# EAGLE schematic STM32 control board (EAGLE 9.6.1)

## Sheet 1 of 2
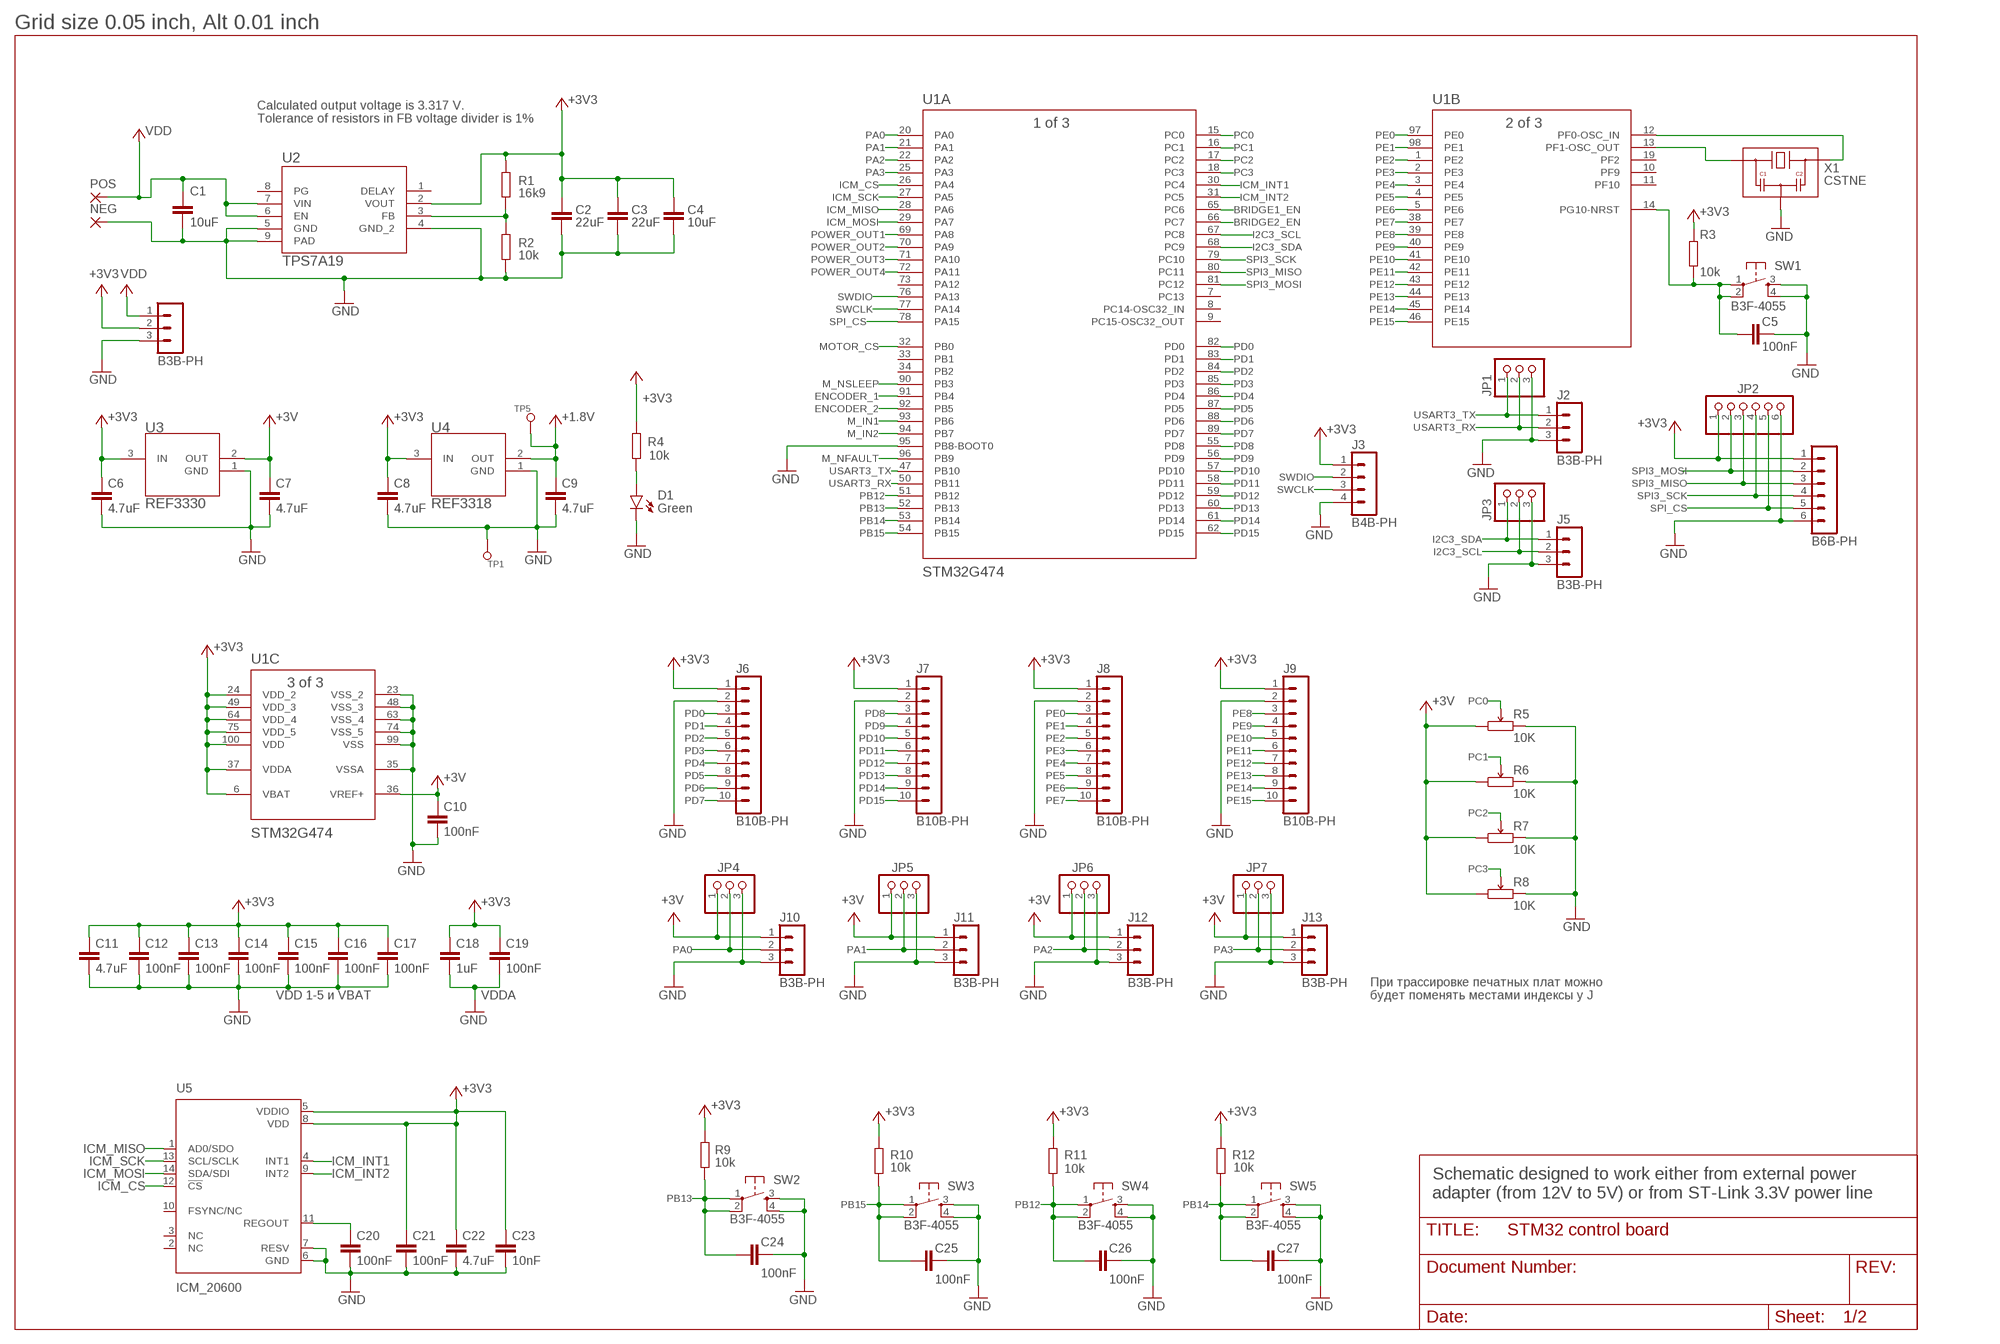
[diagram p0: schematic, sheet 1]

### Parts
C1  10uF  C-EU-CERAMIC1206  [C1206]
C2  22uF  C-EU-CERAMIC1210  [C1210]
C3  22uF  C-EU-CERAMIC1210  [C1210]
C4  10uF  C-EU-CERAMIC1206  [C1206]
C5  100nF  C-EU-CERAMIC0402  [C0402]
C6  4.7uF  C-EU-CERAMIC0603  [C0603]
C7  4.7uF  C-EU-CERAMIC0603  [C0603]
C8  4.7uF  C-EU-CERAMIC0603  [C0603]
C9  4.7uF  C-EU-CERAMIC0603  [C0603]
C10  100nF  C-EU-CERAMIC0402  [C0402]
C11  4.7uF  C-EU-CERAMIC0603  [C0603]
C12  100nF  C-EU-CERAMIC0402  [C0402]
C13  100nF  C-EU-CERAMIC0402  [C0402]
C14  100nF  C-EU-CERAMIC0402  [C0402]
C15  100nF  C-EU-CERAMIC0402  [C0402]
C16  100nF  C-EU-CERAMIC0402  [C0402]
C17  100nF  C-EU-CERAMIC0402  [C0402]
C18  1uF  C-EU-CERAMIC0603  [C0603]
C19  100nF  C-EU-CERAMIC0402  [C0402]
C20  100nF  C-EU-CERAMIC0402  [C0402]
C21  100nF  C-EU-CERAMIC0402  [C0402]
C22  4.7uF  C-EU-CERAMIC0603  [C0603]
C23  10nF  C-EU-CERAMIC0402  [C0402]
C24  100nF  C-EU-CERAMIC0402  [C0402]
C25  100nF  C-EU-CERAMIC0402  [C0402]
C26  100nF  C-EU-CERAMIC0402  [C0402]
C27  100nF  C-EU-CERAMIC0402  [C0402]
D1  Green  LED0805CLEAR  [LED-0805-CLEAR]
J1  B3B-PH  [B3B-PH-K]
J2  B3B-PH  [B3B-PH-K]
J3  B4B-PH  [B4B-PH-K]
J4  B6B-PH  [B6B-PH-K]
J5  B3B-PH  [B3B-PH-K]
J6  B10B-PH  [B10B-PH-K]
J7  B10B-PH  [B10B-PH-K]
J8  B10B-PH  [B10B-PH-K]
J9  B10B-PH  [B10B-PH-K]
J10  B3B-PH  [B3B-PH-K]
J11  B3B-PH  [B3B-PH-K]
J12  B3B-PH  [B3B-PH-K]
J13  B3B-PH  [B3B-PH-K]
JP1  PINHD-1X3  [1X03]
JP2  PINHD-1X6-OCT  [1X06]
JP3  PINHD-1X3  [1X03]
JP4  PINHD-1X3  [1X03]
JP5  PINHD-1X3  [1X03]
JP6  PINHD-1X3  [1X03]
JP7  PINHD-1X3  [1X03]
NEG  SMD_PAD  [SMD_PAD]
POS  SMD_PAD  [SMD_PAD]
R1  16k9  R-EU0402  [R0402]
R2  10k  R-EU0402  [R0402]
R3  10k  R-EU0402  [R0402]
R4  10k  R-EU0402  [R0402]
R5  10K  POTEMTIOMETER_EULONG  [ALPS_PTM_LONG]
R6  10K  POTEMTIOMETER_EULONG  [ALPS_PTM_LONG]
R7  10K  POTEMTIOMETER_EULONG  [ALPS_PTM_LONG]
R8  10K  POTEMTIOMETER_EULONG  [ALPS_PTM_LONG]
R9  10k  R-EU0402  [R0402]
R10  10k  R-EU0402  [R0402]
R11  10k  R-EU0402  [R0402]
R12  10k  R-EU0402  [R0402]
SW1  B3F-4055  [SWITCH_B3F-4055]
SW2  B3F-4055  [SWITCH_B3F-4055]
SW3  B3F-4055  [SWITCH_B3F-4055]
SW4  B3F-4055  [SWITCH_B3F-4055]
SW5  B3F-4055  [SWITCH_B3F-4055]
TP1  1.8  TEST_PAD-[1.27MM_SK]  [TP1.27MM_MASK_SILKSCREEN]
TP5  1.8  TEST_PAD-[1.27MM_SK]  [TP1.27MM_MASK_SILKSCREEN]
U1  STM32G474  STM32G4_LPQFP100  [LPQFP-100]
U2  TPS7A19  TPS7A1901DRBTSON8  [DRB0008B]
U3  REF3330  REF33  [SOT-23-3]
U4  REF3318  REF33  [SOT-23-3]
U5  ICM_20600  [14_PIN_LGA]
X1  CSTNE  [MURATA_SMD_3P]

### Nets
+1.8V: C9.1 TP5.1 U4.2(OUT) ; also sheet 2
+3V: C7.1 C10.1 J10.1 J11.1 J12.1 J13.1 JP4.1 JP5.1 JP6.1 JP7.1 R5.P$1 R6.P$1 R7.P$1 R8.P$1 U1.36(C:VREF+) U3.2(OUT)
+3V3: C2.1 C3.1 C4.1 C6.1 C8.1 C11.1 C12.1 C13.1 C14.1 C15.1 C16.1 C17.1 C18.1 C19.1 C21.1 C22.1 C23.1 J1.2 J3.1 J4.1 J6.1 J7.1 J8.1 J9.1 JP2.1 R1.2 R3.1 R4.2 R9.2 R10.2 R11.2 R12.2 U1.6(C:VBAT) U1.24(C:VDD_2) U1.37(C:VDDA) U1.49(C:VDD_3) U1.64(C:VDD_4) U1.75(C:VDD_5) U1.100(C:VDD) U2.2(VOUT) U3.3(IN) U4.3(IN) U5.5(VDDIO) U5.8(VDD) ; also sheet 2
BRIDGE1_EN: U1.65(A:PC6) ; also sheet 2
BRIDGE2_EN: U1.66(A:PC7) ; also sheet 2
ENCODER_1: U1.91(A:PB4) ; also sheet 2
ENCODER_2: U1.92(A:PB5) ; also sheet 2
GND: C1.2 C2.2 C3.2 C4.2 C5.2 C6.2 C7.2 C8.2 C9.2 C10.2 C11.2 C12.2 C13.2 C14.2 C15.2 C16.2 C17.2 C18.2 C19.2 C20.2 C21.2 C22.2 C23.2 C24.2 C25.2 C26.2 C27.2 D1.-(C) J1.3 J2.3 J3.4 J4.6 J5.3 J6.2 J7.2 J8.2 J9.2 J10.3 J11.3 J12.3 J13.3 JP1.3 JP2.6 JP3.3 JP4.3 JP5.3 JP6.3 JP7.3 NEG.1(P) R2.1 R5.P$3 R6.P$3 R7.P$3 R8.P$3 SW1.3 SW1.4 SW2.3 SW2.4 SW3.3 SW3.4 SW4.3 SW4.4 SW5.3 SW5.4 TP1.1 U1.23(C:VSS_2) U1.35(C:VSSA) U1.48(C:VSS_3) U1.63(C:VSS_4) U1.74(C:VSS_5) U1.95(A:PB8-BOOT0) U1.99(C:VSS) U2.4(GND_2) U2.5(GND) U2.9(PAD) U3.1(GND) U4.1(GND) U5.6(GND) U5.7(RESV) X1.2(GND) ; also sheet 2
I2C3_SCL: J5.2 JP3.2 U1.67(A:PC8)
I2C3_SDA: J5.1 JP3.1 U1.68(A:PC9)
ICM_CS [ICM20600]: U1.26(A:PA4) U5.12(!CS)
ICM_INT1 [ICM20600]: U1.30(A:PC4) U5.4(INT1)
ICM_INT2 [ICM20600]: U1.31(A:PC5) U5.9(INT2)
ICM_MISO [ICM20600]: U1.28(A:PA6) U5.1(AD0/SDO)
ICM_MOSI [ICM20600]: U1.29(A:PA7) U5.14(SDA/SDI)
ICM_SCK [ICM20600]: U1.27(A:PA5) U5.13(SCL/SCLK)
M_IN1: U1.93(A:PB6) ; also sheet 2
M_IN2: U1.94(A:PB7) ; also sheet 2
M_NFAULT: U1.96(A:PB9) ; also sheet 2
M_NSLEEP: U1.90(A:PB3) ; also sheet 2
MOTOR_CS: U1.32(A:PB0) ; also sheet 2
N$1: U1.12(B:PF0-OSC_IN) X1.3(OUT)
N$2: U1.13(B:PF1-OSC_OUT) X1.1(IN)
N$7: D1.+(A) R4.1
N$21: R1.1 R2.2 U2.3(FB)
PA0: J10.2 JP4.2 U1.20(A:PA0)
PA1: J11.2 JP5.2 U1.21(A:PA1)
PA2: J12.2 JP6.2 U1.22(A:PA2)
PA3: J13.2 JP7.2 U1.25(A:PA3)
PB12: C26.1 R11.1 SW4.1 SW4.2 U1.51(A:PB12)
PB13: C24.1 R9.1 SW2.1 SW2.2 U1.52(A:PB13)
PB14: C27.1 R12.1 SW5.1 SW5.2 U1.53(A:PB14)
PB15: C25.1 R10.1 SW3.1 SW3.2 U1.54(A:PB15)
PC0: R5.P$2 U1.15(A:PC0)
PC1: R6.P$2 U1.16(A:PC1)
PC2: R7.P$2 U1.17(A:PC2)
PC3: R8.P$2 U1.18(A:PC3)
PD0: J6.3 U1.82(A:PD0) ; also sheet 2
PD1: J6.4 U1.83(A:PD1) ; also sheet 2
PD2: J6.5 U1.84(A:PD2) ; also sheet 2
PD3: J6.6 U1.85(A:PD3) ; also sheet 2
PD4: J6.7 U1.86(A:PD4) ; also sheet 2
PD5: J6.8 U1.87(A:PD5) ; also sheet 2
PD6: J6.9 U1.88(A:PD6) ; also sheet 2
PD7: J6.10 U1.89(A:PD7) ; also sheet 2
PD8: J7.3 U1.55(A:PD8) ; also sheet 2
PD9: J7.4 U1.56(A:PD9) ; also sheet 2
PD10: J7.5 U1.57(A:PD10) ; also sheet 2
PD11: J7.6 U1.58(A:PD11) ; also sheet 2
PD12: J7.7 U1.59(A:PD12) ; also sheet 2
PD13: J7.8 U1.60(A:PD13) ; also sheet 2
PD14: J7.9 U1.61(A:PD14) ; also sheet 2
PD15: J7.10 U1.62(A:PD15) ; also sheet 2
PE0: J8.3 U1.97(B:PE0) ; also sheet 2
PE1: J8.4 U1.98(B:PE1) ; also sheet 2
PE2: J8.5 U1.1(B:PE2) ; also sheet 2
PE3: J8.6 U1.2(B:PE3) ; also sheet 2
PE4: J8.7 U1.3(B:PE4) ; also sheet 2
PE5: J8.8 U1.4(B:PE5) ; also sheet 2
PE6: J8.9 U1.5(B:PE6) ; also sheet 2
PE7: J8.10 U1.38(B:PE7) ; also sheet 2
PE8: J9.3 U1.39(B:PE8) ; also sheet 2
PE9: J9.4 U1.40(B:PE9) ; also sheet 2
PE10: J9.5 U1.41(B:PE10) ; also sheet 2
PE11: J9.6 U1.42(B:PE11) ; also sheet 2
PE12: J9.7 U1.43(B:PE12) ; also sheet 2
PE13: J9.8 U1.44(B:PE13) ; also sheet 2
PE14: J9.9 U1.45(B:PE14) ; also sheet 2
PE15: J9.10 U1.46(B:PE15) ; also sheet 2
POWER_OUT1: U1.69(A:PA8) ; also sheet 2
POWER_OUT2: U1.70(A:PA9) ; also sheet 2
POWER_OUT3: U1.71(A:PA10) ; also sheet 2
POWER_OUT4: U1.72(A:PA11) ; also sheet 2
REG: C20.1 U5.11(REGOUT)
RST: C5.1 R3.2 SW1.1 SW1.2 U1.14(B:PG10-NRST)
SPI3_MISO: J4.3 JP2.3 U1.80(A:PC11)
SPI3_MOSI: J4.2 JP2.2 U1.81(A:PC12)
SPI3_SCK: J4.4 JP2.4 U1.79(A:PC10)
SPI_CS: J4.5 JP2.5 U1.78(A:PA15)
SWCLK: J3.3 U1.77(A:PA14)
SWDIO: J3.2 U1.76(A:PA13)
USART3_RX: J2.2 JP1.2 U1.50(A:PB11)
USART3_TX: J2.1 JP1.1 U1.47(A:PB10)
VDD: C1.1 J1.1 POS.1(P) U2.6(EN) U2.7(VIN) ; also sheet 2
Unconnected: U1.7(A:PC13) U1.8(A:PC14-OSC32_IN) U1.9(A:PC15-OSC32_OUT) U1.10(B:PF9) U1.11(B:PF10) U1.19(B:PF2) U1.33(A:PB1) U1.34(A:PB2) U1.73(A:PA12) U2.1(DELAY) U2.8(PG) U5.2(NC) U5.3(NC) U5.10(FSYNC/NC)

### Notes on the sheet
- Grid size 0.05 inch, Alt 0.01 inch
- Calculated output voltage is 3.317 V.
  Tolerance of resistors in FB voltage divider is 1%
- VDD 1-5 и VBAT | VDDA
- При трассировке печатных плат можно
  будет поменять местами индексы у J
- Schematic designed to work either from external power 
  adapter (from 12V to 5V) or from ST-Link 3.3V power line

## Sheet 2 of 2
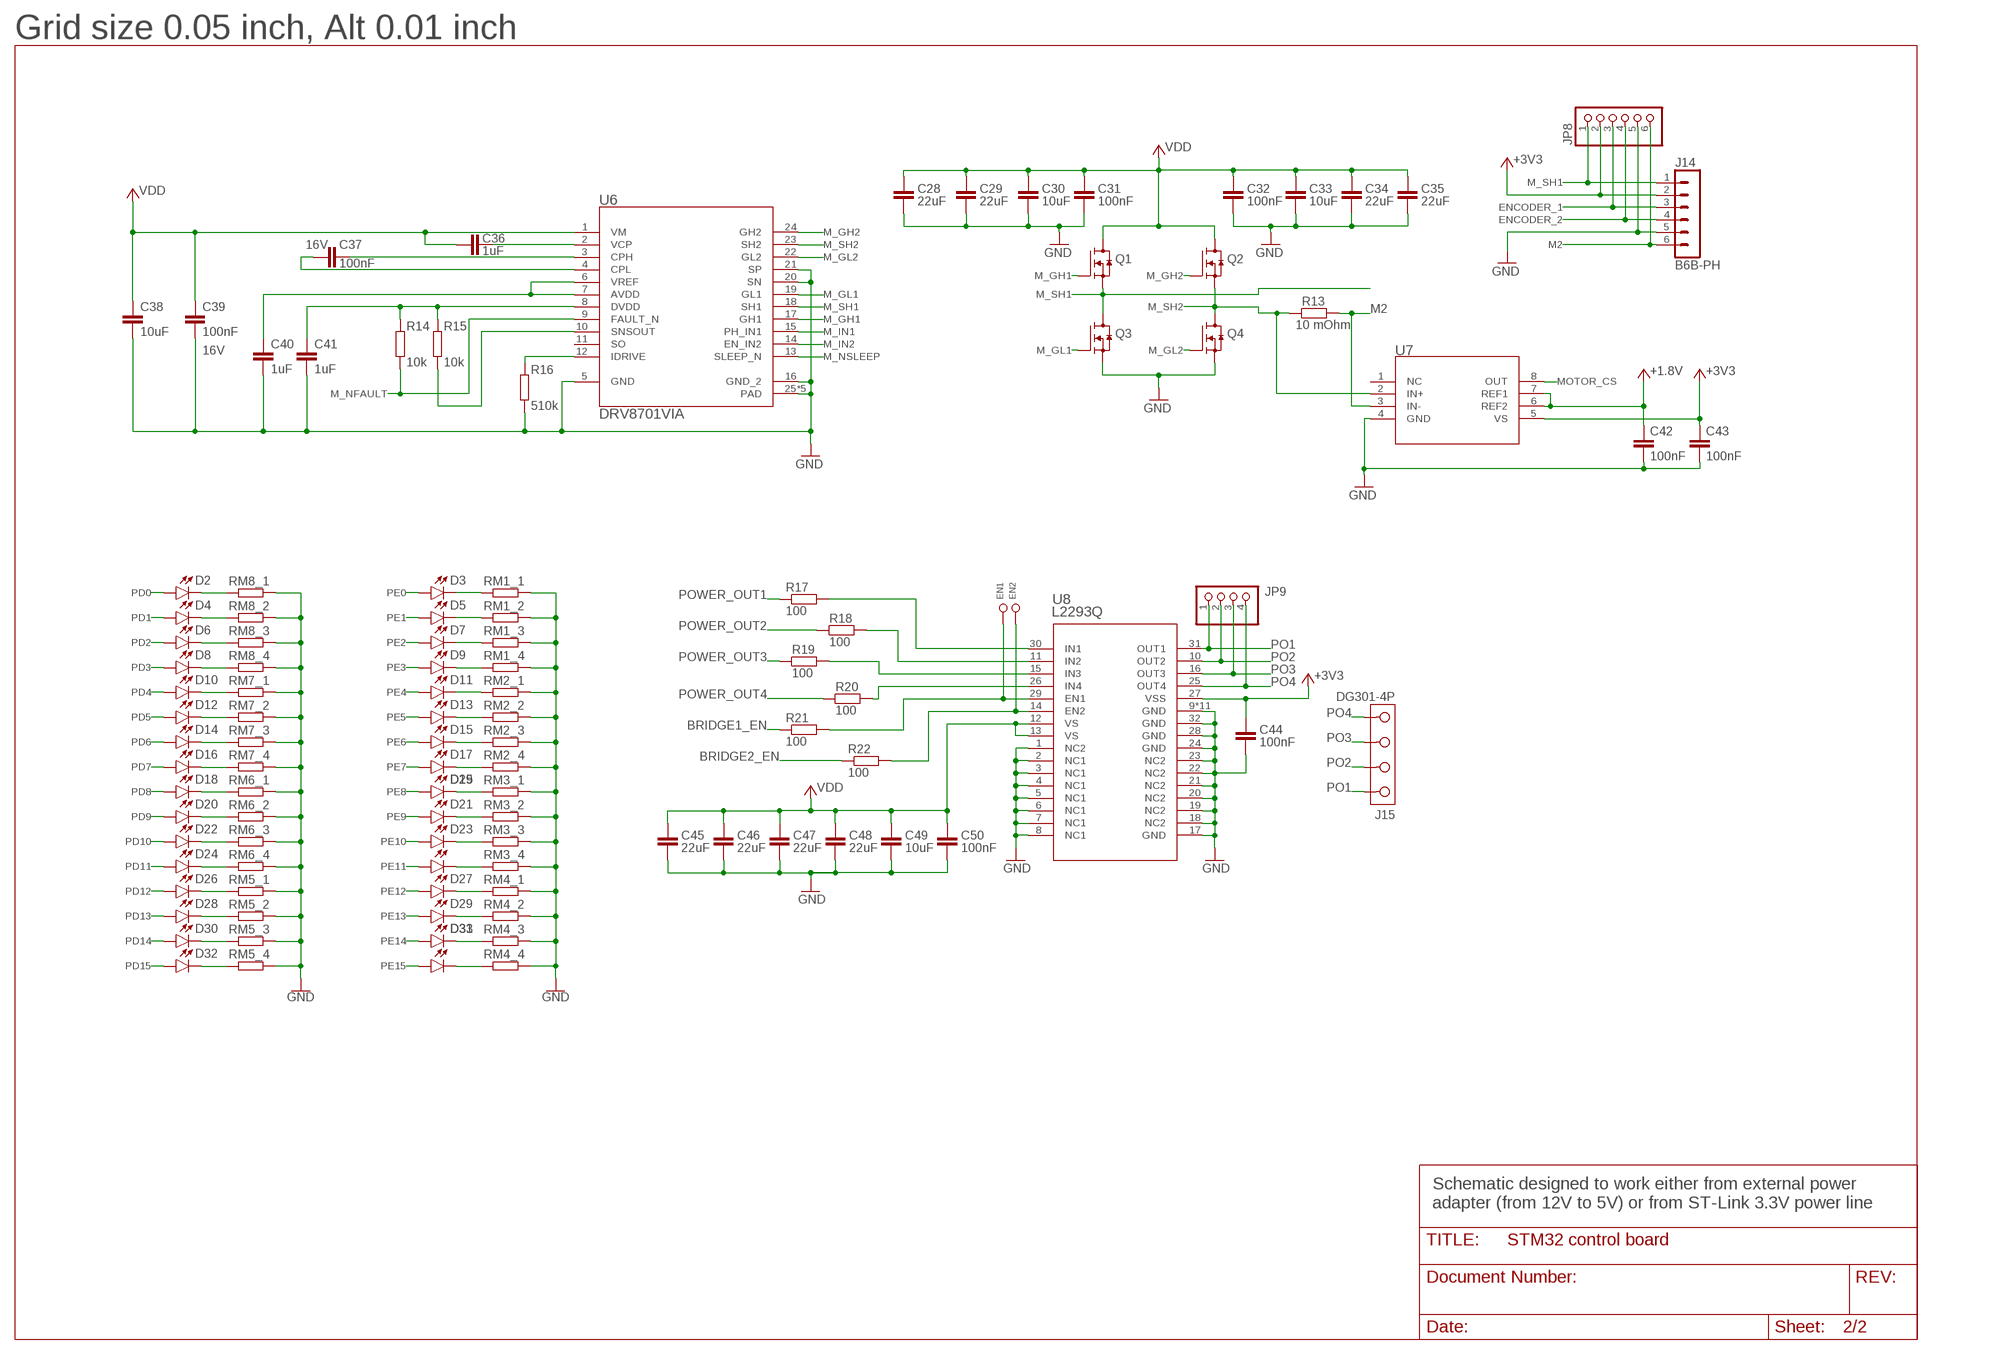
[diagram p1: schematic, sheet 2]

### Parts
C28  22uF  C-EU-CERAMIC1210  [C1210]
C29  22uF  C-EU-CERAMIC1210  [C1210]
C30  10uF  C-EU-CERAMIC1206  [C1206]
C31  100nF  C-EU-CERAMIC0402  [C0402]
C32  100nF  C-EU-CERAMIC0402  [C0402]
C33  10uF  C-EU-CERAMIC1206  [C1206]
C34  22uF  C-EU-CERAMIC1210  [C1210]
C35  22uF  C-EU-CERAMIC1210  [C1210]
C36  1uF  C-EU-CERAMIC0603  [C0603]
C37  100nF  C-EU-CERAMIC0402  [C0402]
C38  10uF  C-EU-CERAMIC1206  [C1206]
C39  100nF  C-EU-CERAMIC0402  [C0402]
C40  1uF  C-EU-CERAMIC0603  [C0603]
C41  1uF  C-EU-CERAMIC0603  [C0603]
C42  100nF  C-EU-CERAMIC0402  [C0402]
C43  100nF  C-EU-CERAMIC0402  [C0402]
C44  100nF  C-EU-CERAMIC0402  [C0402]
C45  22uF  C-EU-CERAMIC1210  [C1210]
C46  22uF  C-EU-CERAMIC1210  [C1210]
C47  22uF  C-EU-CERAMIC1210  [C1210]
C48  22uF  C-EU-CERAMIC1210  [C1210]
C49  10uF  C-EU-CERAMIC1206  [C1206]
C50  100nF  C-EU-CERAMIC0402  [C0402]
D2  Blue  LED0805CLEAR  [LED-0805-CLEAR]
D3  Blue  LED0805CLEAR  [LED-0805-CLEAR]
D4  Blue  LED0805CLEAR  [LED-0805-CLEAR]
D5  Blue  LED0805CLEAR  [LED-0805-CLEAR]
D6  Blue  LED0805CLEAR  [LED-0805-CLEAR]
D7  Blue  LED0805CLEAR  [LED-0805-CLEAR]
D8  Blue  LED0805CLEAR  [LED-0805-CLEAR]
D9  Blue  LED0805CLEAR  [LED-0805-CLEAR]
D10  Blue  LED0805CLEAR  [LED-0805-CLEAR]
D11  Blue  LED0805CLEAR  [LED-0805-CLEAR]
D12  Blue  LED0805CLEAR  [LED-0805-CLEAR]
D13  Blue  LED0805CLEAR  [LED-0805-CLEAR]
D14  Blue  LED0805CLEAR  [LED-0805-CLEAR]
D15  Blue  LED0805CLEAR  [LED-0805-CLEAR]
D16  Blue  LED0805CLEAR  [LED-0805-CLEAR]
D17  Blue  LED0805CLEAR  [LED-0805-CLEAR]
D18  Blue  LED0805CLEAR  [LED-0805-CLEAR]
D19  Blue  LED0805CLEAR  [LED-0805-CLEAR]
D20  Blue  LED0805CLEAR  [LED-0805-CLEAR]
D21  Blue  LED0805CLEAR  [LED-0805-CLEAR]
D22  Blue  LED0805CLEAR  [LED-0805-CLEAR]
D23  Blue  LED0805CLEAR  [LED-0805-CLEAR]
D24  Blue  LED0805CLEAR  [LED-0805-CLEAR]
D25  Blue  LED0805CLEAR  [LED-0805-CLEAR]
D26  Blue  LED0805CLEAR  [LED-0805-CLEAR]
D27  Blue  LED0805CLEAR  [LED-0805-CLEAR]
D28  Blue  LED0805CLEAR  [LED-0805-CLEAR]
D29  Blue  LED0805CLEAR  [LED-0805-CLEAR]
D30  Blue  LED0805CLEAR  [LED-0805-CLEAR]
D31  Blue  LED0805CLEAR  [LED-0805-CLEAR]
D32  Blue  LED0805CLEAR  [LED-0805-CLEAR]
D33  Blue  LED0805CLEAR  [LED-0805-CLEAR]
EN1  TEST_PAD-[1.27MM_SK]  [TP1.27MM_MASK_SILKSCREEN]
EN2  TEST_PAD-[1.27MM_SK]  [TP1.27MM_MASK_SILKSCREEN]
J14  B6B-PH  [B6B-PH-K]
J15  DG301-4P  [DG301-4P]
JP8  PINHD-1X6-OCT  [1X06]
JP9  PINHD-1X4  [1X04]
Q1  CSD15571Q2  [SON2X2]
Q2  CSD15571Q2  [SON2X2]
Q3  CSD15571Q2  [SON2X2]
Q4  CSD15571Q2  [SON2X2]
R13  10 mOhm  R_EU_CS  [CS_R0805]
R14  10k  R-EU0402  [R0402]
R15  10k  R-EU0402  [R0402]
R16  510k  R-EU0402  [R0402]
R17  100  R-EU0402  [R0402]
R18  100  R-EU0402  [R0402]
R19  100  R-EU0402  [R0402]
R20  100  R-EU0402  [R0402]
R21  100  R-EU0402  [R0402]
R22  100  R-EU0402  [R0402]
RM1  RES_ARRAY0603  [0603-ARC]
RM2  RES_ARRAY0603  [0603-ARC]
RM3  RES_ARRAY0603  [0603-ARC]
RM4  RES_ARRAY0603  [0603-ARC]
RM5  RES_ARRAY0603  [0603-ARC]
RM6  RES_ARRAY0603  [0603-ARC]
RM7  RES_ARRAY0603  [0603-ARC]
RM8  RES_ARRAY0603  [0603-ARC]
U6  DRV8701VIA  [VQFN-24-VIA]
U7  INA240_TSSOP  [TSSOP-8]
U8  L2293Q  [QFN_293Q_STM]

### Nets
+1.8V: C42.1 U7.6(REF2) U7.7(REF1) ; also sheet 1
+3V3: C43.1 C44.1 J14.2 JP8.2 U7.5(VS) U8.27(VSS) ; also sheet 1
AVDD1: C40.2 U6.6(VREF) U6.7(AVDD)
BRIDGE1_EN: R21.1 ; also sheet 1
BRIDGE2_EN: R22.1 ; also sheet 1
DRV2_SNSOUT: R15.1 U6.10(SNSOUT)
DVDD2: C41.2 R14.2 R15.2 U6.8(DVDD)
EN1: EN1.1 R21.2 U8.29(EN1)
EN2: EN2.1 R22.2 U8.14(EN2)
ENCODER_1: J14.3 JP8.3 ; also sheet 1
ENCODER_2: J14.4 JP8.4 ; also sheet 1
GND: C28.2 C29.2 C30.2 C31.2 C32.2 C33.2 C34.2 C35.2 C38.2 C39.2 C40.1 C41.1 C42.2 C43.2 C44.2 C45.2 C46.2 C47.2 C48.2 C49.2 C50.2 J14.5 JP8.5 Q3.S4(S) Q3.S8(S) Q4.S4(S) Q4.S8(S) R16.1 RM1.1 RM1.2 RM1.3 RM1.4 RM2.1 RM2.2 RM2.3 RM2.4 RM3.1 RM3.2 RM3.3 RM3.4 RM4.1 RM4.2 RM4.3 RM4.4 RM5.1 RM5.2 RM5.3 RM5.4 RM6.1 RM6.2 RM6.3 RM6.4 RM7.1 RM7.2 RM7.3 RM7.4 RM8.1 RM8.2 RM8.3 RM8.4 U6.5(GND) U6.16(GND_2) U6.20(SN) U6.21(SP) U6.25(PAD) U6.26(PAD) U6.27(PAD) U6.28(PAD) U6.29(PAD) U7.4(GND) U8.1(NC2) U8.2(NC1) U8.3(NC1) U8.4(NC1) U8.5(NC1) U8.6(NC1) U8.7(NC1) U8.8(NC1) U8.9(GND) U8.17(GND) U8.18(NC2) U8.19(NC2) U8.20(NC2) U8.21(NC2) U8.22(NC2) U8.23(NC2) U8.24(GND) U8.28(GND) U8.32(GND) U8.P$1(GND) U8.P$2(GND) U8.P$3(GND) U8.P$4(GND) U8.P$5(GND) U8.P$6(GND) U8.P$7(GND) U8.P$8(GND) U8.P$9(GND) U8.PAD(GND) ; also sheet 1
M2: J14.6 JP8.6 R13.2 U7.3(IN-)
M_GH1: Q1.G3(G) U6.17(GH1)
M_GH2: Q2.G3(G) U6.24(GH2)
M_GL1: Q3.G3(G) U6.19(GL1)
M_GL2: Q4.G3(G) U6.22(GL2)
M_IN1: U6.15(PH_IN1) ; also sheet 1
M_IN2: U6.14(EN_IN2) ; also sheet 1
M_NFAULT: R14.1 U6.9(FAULT_N) ; also sheet 1
M_NSLEEP: U6.13(SLEEP_N) ; also sheet 1
M_SH1: J14.1 JP8.1 Q1.S4(S) Q1.S8(S) Q3.D1(D) Q3.D2(D) Q3.D5(D) Q3.D6(D) Q3.D7(D) U6.18(SH1)
M_SH2: Q2.S4(S) Q2.S8(S) Q4.D1(D) Q4.D2(D) Q4.D5(D) Q4.D6(D) Q4.D7(D) R13.1 U6.23(SH2) U7.2(IN+)
MOTOR_CS: U7.8(OUT) ; also sheet 1
N$3: D16.-(C) RM7.5
N$4: D14.-(C) RM7.6
N$5: D12.-(C) RM7.7
N$6: D10.-(C) RM7.8
N$8: R17.2 U8.30(IN1)
N$9: D2.-(C) RM8.8
N$10: D4.-(C) RM8.7
N$11: D6.-(C) RM8.6
N$12: D8.-(C) RM8.5
N$15: R18.2 U8.11(IN2)
N$16: R19.2 U8.15(IN3)
N$18: R20.2 U8.26(IN4)
N$23: D18.-(C) RM6.8
N$24: C37.1 U6.3(CPH)
N$25: D20.-(C) RM6.7
N$26: D22.-(C) RM6.6
N$27: D24.-(C) RM6.5
N$28: D26.-(C) RM5.8
N$29: D28.-(C) RM5.7
N$30: D30.-(C) RM5.6
N$31: D32.-(C) RM5.5
N$32: C37.2 U6.4(CPL)
N$33: C36.2 U6.2(VCP)
N$34: D3.-(C) RM1.8
N$35: D5.-(C) RM1.7
N$36: D7.-(C) RM1.6
N$37: R16.2 U6.12(IDRIVE)
N$38: D9.-(C) RM1.5
N$39: D11.-(C) RM2.8
N$40: D13.-(C) RM2.7
N$41: D15.-(C) RM2.6
N$42: D17.-(C) RM2.5
N$43: D19.-(C) RM3.8
N$44: D21.-(C) RM3.7
N$45: D23.-(C) RM3.6
N$46: D25.-(C) RM3.5
N$47: D27.-(C) RM4.8
N$48: D29.-(C) RM4.7
N$49: D31.-(C) RM4.6
N$50: D33.-(C) RM4.5
PD0: D2.+(A) ; also sheet 1
PD1: D4.+(A) ; also sheet 1
PD2: D6.+(A) ; also sheet 1
PD3: D8.+(A) ; also sheet 1
PD4: D10.+(A) ; also sheet 1
PD5: D12.+(A) ; also sheet 1
PD6: D14.+(A) ; also sheet 1
PD7: D16.+(A) ; also sheet 1
PD8: D18.+(A) ; also sheet 1
PD9: D20.+(A) ; also sheet 1
PD10: D22.+(A) ; also sheet 1
PD11: D24.+(A) ; also sheet 1
PD12: D26.+(A) ; also sheet 1
PD13: D28.+(A) ; also sheet 1
PD14: D30.+(A) ; also sheet 1
PD15: D32.+(A) ; also sheet 1
PE0: D3.+(A) ; also sheet 1
PE1: D5.+(A) ; also sheet 1
PE2: D7.+(A) ; also sheet 1
PE3: D9.+(A) ; also sheet 1
PE4: D11.+(A) ; also sheet 1
PE5: D13.+(A) ; also sheet 1
PE6: D15.+(A) ; also sheet 1
PE7: D17.+(A) ; also sheet 1
PE8: D19.+(A) ; also sheet 1
PE9: D21.+(A) ; also sheet 1
PE10: D23.+(A) ; also sheet 1
PE11: D25.+(A) ; also sheet 1
PE12: D27.+(A) ; also sheet 1
PE13: D29.+(A) ; also sheet 1
PE14: D31.+(A) ; also sheet 1
PE15: D33.+(A) ; also sheet 1
PO1: J15.1 JP9.1 U8.31(OUT1)
PO2: J15.2 JP9.2 U8.10(OUT2)
PO3: J15.3 JP9.3 U8.16(OUT3)
PO4: J15.4 JP9.4 U8.25(OUT4)
POWER_OUT1: R17.1 ; also sheet 1
POWER_OUT2: R18.1 ; also sheet 1
POWER_OUT3: R19.1 ; also sheet 1
POWER_OUT4: R20.1 ; also sheet 1
VDD: C28.1 C29.1 C30.1 C31.1 C32.1 C33.1 C34.1 C35.1 C36.1 C38.1 C39.1 C45.1 C46.1 C47.1 C48.1 C49.1 C50.1 Q1.D1(D) Q1.D2(D) Q1.D5(D) Q1.D6(D) Q1.D7(D) Q2.D1(D) Q2.D2(D) Q2.D5(D) Q2.D6(D) Q2.D7(D) U6.1(VM) U8.12(VS) U8.13(VS) ; also sheet 1
Unconnected: U6.11(SO) U7.1(NC)

### Notes on the sheet
- Grid size 0.05 inch, Alt 0.01 inch
- 16V
- 16V
- Schematic designed to work either from external power 
  adapter (from 12V to 5V) or from ST-Link 3.3V power line

## Library data of the parts
C1 C4 C30 C33 C38 C49 = Capacitors:C-EU-CERAMIC: MLCC footprints for reflow soldering According to https://docs.google.com/document/d/1dteNWmS3K0-mGsqeLvja9cdOfhO5witaUV6Y-umTd90/edit?usp=sharing Last edit 23.05.2020 by Denis Yaskevich, denis.jaskevich@yandex.by; MANUFACTURER_PART_NUMBER: CL31B106KAHNNNE
C2 C3 C28 C29 C34 C35 C45-C48 = Capacitors:C-EU-CERAMIC: MLCC footprints for reflow soldering According to https://docs.google.com/document/d/1dteNWmS3K0-mGsqeLvja9cdOfhO5witaUV6Y-umTd90/edit?usp=sharing Last edit 23.05.2020 by Denis Yaskevich, denis.jaskevich@yandex.by; MANUFACTURER_PART_NUMBER: GRM32ER61C476ME15L
C5-C27 C31 C32 C36 C37 C39-C44 C50 = Capacitors:C-EU-CERAMIC: MLCC footprints for reflow soldering According to https://docs.google.com/document/d/1dteNWmS3K0-mGsqeLvja9cdOfhO5witaUV6Y-umTd90/edit?usp=sharing Last edit 23.05.2020 by Denis Yaskevich, denis.jaskevich@yandex.by
D1-D33 = Semiconductor_devices:LED0805: LED Model suitable for all 0805 leds Updated: 22.10.19 by Andrey Dovnar, andrevdovnar@gmail.com
EN1 EN2 TP1 TP5 = testing:TEST_PAD: Test point SMD Updated: 05.11.19 by Andrey Dovnar, andrevdovnar@gmail.com
J1 J2 J5 J10-J13 = con-jst-ph:B3B-PH: Wire to board connector Model suitable for B3B-PH-K Updated: 21.10.19 by Andrey Dovnar, andrevdovnar@gmail.com
J3 = con-jst-ph:B4B-PH: Wire to board connector Model suitable for B4B-PH-K Updated: 21.10.19 by Andrey Dovnar, andrevdovnar@gmail.com
J4 J14 = con-jst-ph:B6B-PH: Wire to board connector Model suitable for B6B-PH-K Updated: 21.10.19 by Andrey Dovnar, andrevdovnar@gmail.com
J6-J9 = con-jst-ph:B10B-PH: Wire to board connector Model suitable for B10B-PH-K Updated: 21.10.19 by Andrey Dovnar, andrevdovnar@gmail.com
J15 = Terminal blocks:DG301-4P
JP1 JP3-JP7 = commonly used connectors:PINHD-1X3: PIN HEADER
JP2 JP8 = commonly used connectors:PINHD-1X6-OCT: PIN HEADER
JP9 = commonly used connectors:PINHD-1X4: PIN HEADER
NEG POS = testing:SMD_PAD: SMD PAD
Q1-Q4 = Transistors:CSD15571Q2; MANUFACTURER_PART_NUMBER: CSD15571Q2
R1-R4 R9-R12 R14-R22 = Resistors:R-EU
R5-R8 = Resistors:POTEMTIOMETER_EU
R13 = Resistors:R_EU_CS; MANUFACTURER_PART_NUMBER: ERJ6CWDR010V
RM1-RM8 = Resistors:RES_ARRAY
SW1-SW5 = buttons and switches:B3F-4055; BUILT_BY: EMA_Cory; COPYRIGHT: Copyright (C) 2018 Accelerated Designs. All rights reserved; MANUFACTURER_PART_NUMBER: B3F-4055; VENDOR: Omron
U1 = stmicroelectronics:STM32G4_LPQFP100; BUILT_BY: EMA_Jessica; COPYRIGHT: Copyright (C) 2016 Accelerated Designs. All rights reserved; MANUFACTURER_PART_NUMBER: STM32G4_LPQFP100_T1; VENDOR: STMicroelectronics
U2 = LDOs:TPS7A1901DRBT: 40-V, 450-mA, Wide VIN, Low IQ, Low-Dropout Voltage Regulator; DATASHEET: https://www.ti.com/lit/ds/symlink/tps7a19.pdf?ts=1594646251403&ref_url=https%253A%252F%252Fwww.google.com%252F; MANUFACTURER_PART_NUMBER: TPS7A1901DRBT
U3 U4 = Voltage references:REF33
U5 = InvenSence:ICM_20600: 6-axis IMU Model suitable for ICM-20600 Created: 18.10.19 by Andrey Dovnar, andrevdovnar@gmail.com Updated: 16.11.19 by Andrey Dovnar, andrevdovnar@gmail.com
U6 = Transistors drivers:DRV8701: Suitable for TI DRV8701P/(E) : H - driver with 47V max Vin and external MOSFETs
U7 = Current sensing:INA240_TSSOP; MANUFACTURER_PART_NUMBER: INA240
U8 = Transistors drivers:L2293Q; MANUFACTURER_PART_NUMBER: L2293Q
X1 = resonators and oscillators:CSTNE: Ceramic Resonator with integrated load capacitors No external components required Model suitable for all Murata electronics resonators from CSTNE_G, CSTNE_V, CSTNE_VH3L and CSTNE_GH5L families Created: 16.11.19 by Andrey Dovnar, andrevdovnar@gmail.com

## Net classes
3 POWER: clearance 0.2 mm